# EAGLE schematic nutzen_03 (EAGLE 9.6.2)

## Sheet 1 of 2
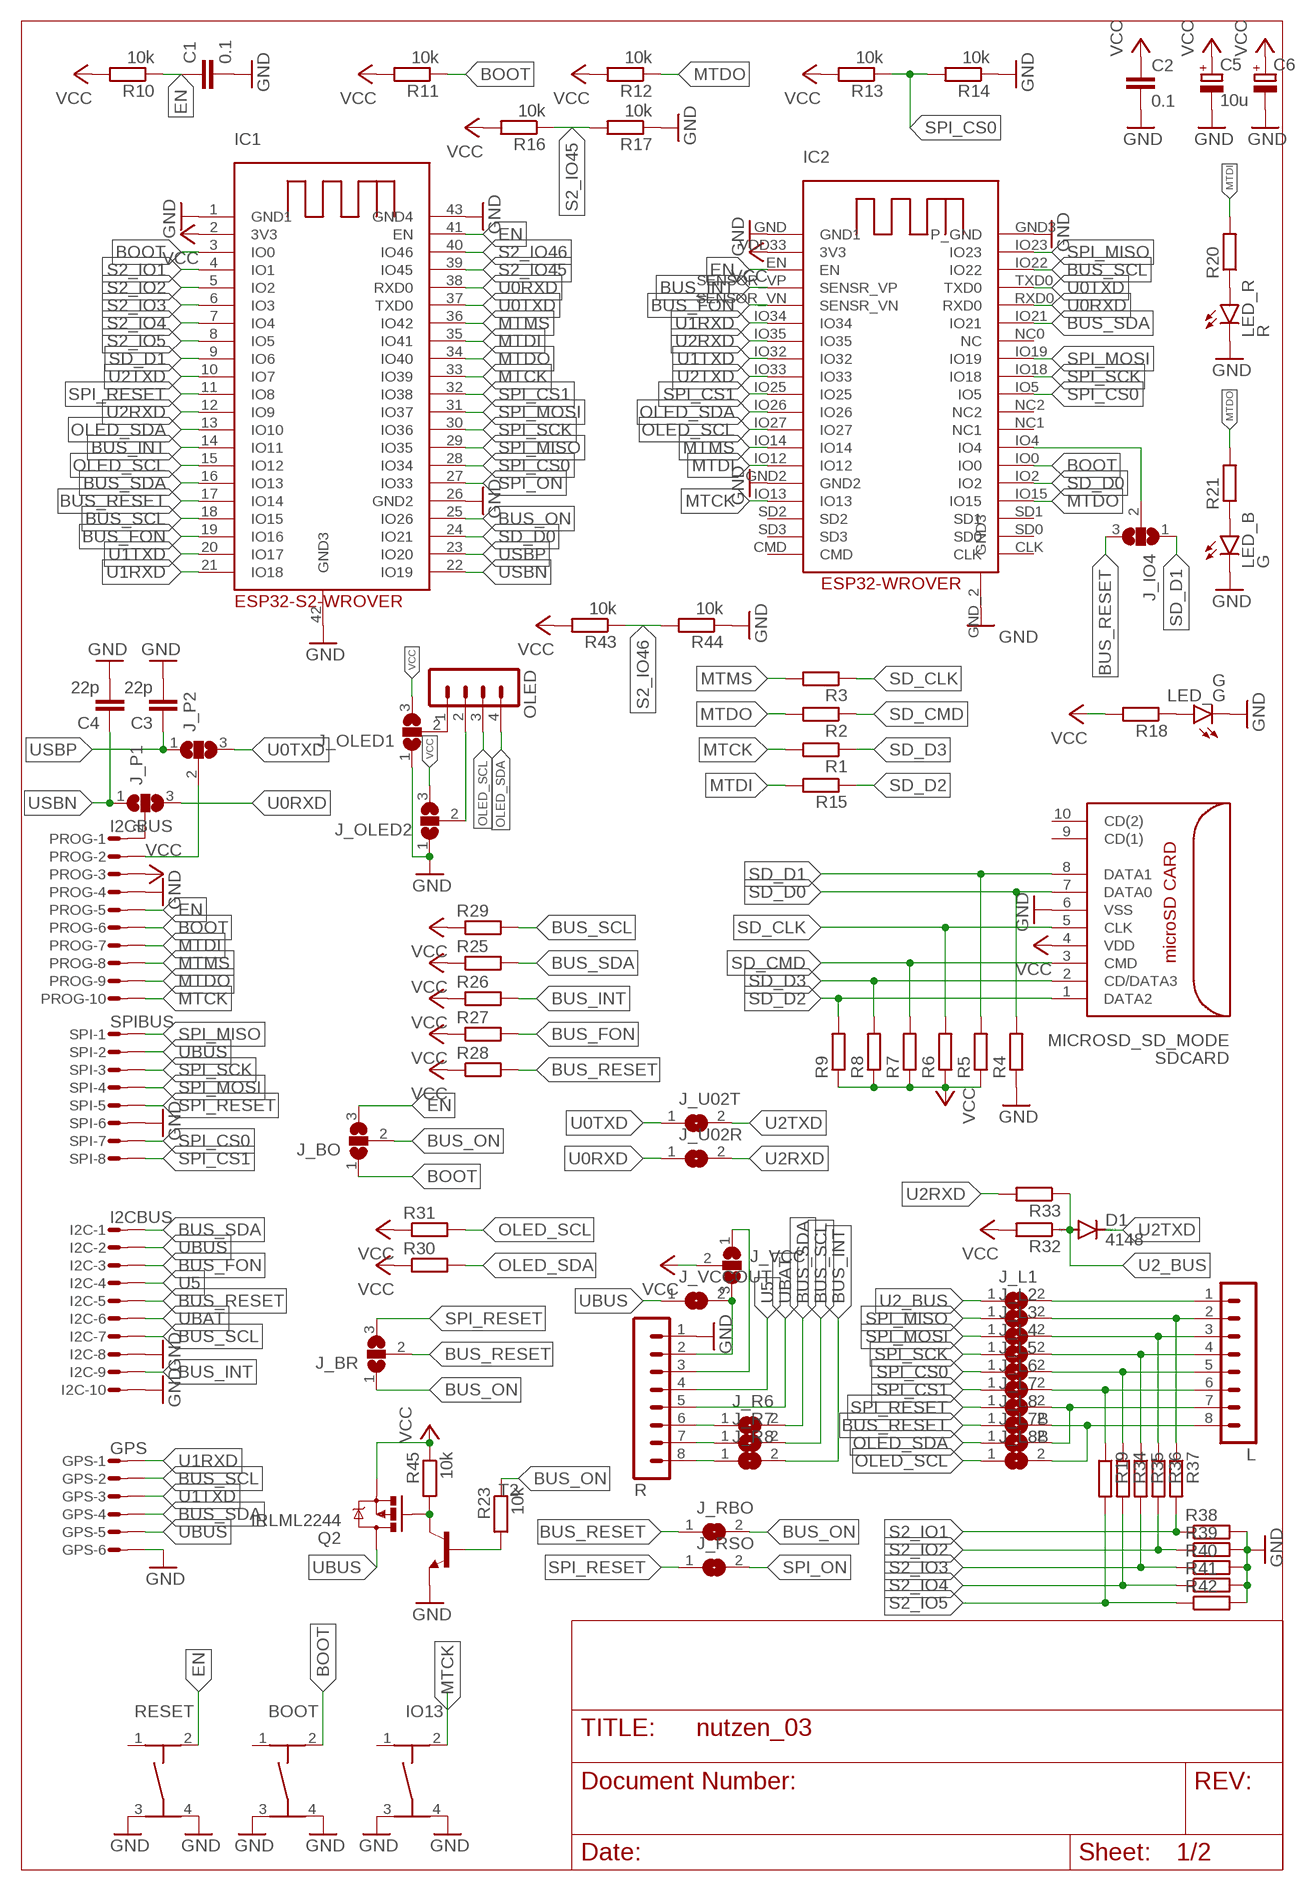
[diagram p0: schematic, sheet 1]

### Parts
BOOT  TASTER-9314_SMD  [TASTER-9314_SMD]
C1  0.1  C-EUC0805  [C0805]
C2  0.1  C-EUC0805  [C0805]
C3  22p  C-EUC0805  [C0805]
C4  22p  C-EUC0805  [C0805]
C5  10u  CPOL-EUB/3528-21W  [B/3528-21W]
C6  CPOL-EUC/6032-28R  [C/6032-28R]
D1  4148  DIODE-MINIMELF  [MINIMELF]
GPS  GPS  MICROMATCH-6SMD  [MICROMATCH-6SMD]
I2C  I2CBUS  MICROMATCH-10SMD  [MICROMATCH-10SMD]
IC1  ESP32-S2_WROVER  [ESP32-S2-WROVER]
IC2  ESP32-WROVER  [ESP32-WROVER]
IO13  TASTER-9314_SMD  [TASTER-9314_SMD]
J_BO  SJ2W  [SJ_2]
J_BR  SJ2W  [SJ_2]
J_IO4  SJ2W  [SJ_2]
J_L1  SJ  [SJ]
J_L2  SJ  [SJ]
J_L3  SJ  [SJ]
J_L4  SJ  [SJ]
J_L5  SJ  [SJ]
J_L6  SJ  [SJ]
J_L7  SJ  [SJ]
J_L7B  SJ  [SJ]
J_L8  SJ  [SJ]
J_L8B  SJ  [SJ]
J_OLED1  SJ2W  [SJ_2]
J_OLED2  SJ2W  [SJ_2]
J_P1  SJ2W  [SJ_2]
J_P2  SJ2W  [SJ_2]
J_R6  SJ  [SJ]
J_R7  SJ  [SJ]
J_R8  SJ  [SJ]
J_RBO  SJ  [SJ]
J_RSO  SJ  [SJ]
J_U02R  SJ  [SJ]
J_U02T  SJ  [SJ]
J_VCC  SJ2W  [SJ_2]
J_VCCOUT  SJ  [SJ]
L  MA08-1  [MA08-1]
LED_B  G  LEDCHIPLED_0805  [CHIPLED_0805]
LED_G  G  LEDCHIPLED_0805  [CHIPLED_0805]
LED_R  R  LEDCHIPLED_0805  [CHIPLED_0805]
OLED  MA04-1  [MA04-1]
PROG  I2CBUS  MICROMATCH-10SMD  [MICROMATCH-10SMD]
Q2  IRLML2244  MOSFET-PCHANNELIRLML2244  [SOT23-3]
R  MA08-1  [MA08-1]
R1  R-EU_R0805  [R0805]
R2  R-EU_R0805  [R0805]
R3  R-EU_R0805  [R0805]
R4  R-EU_R0805  [R0805]
R5  R-EU_R0805  [R0805]
R6  R-EU_R0805  [R0805]
R7  R-EU_R0805  [R0805]
R8  R-EU_R0805  [R0805]
R9  R-EU_R0805  [R0805]
R10  10k  R-EU_R0805  [R0805]
R11  10k  R-EU_R0805  [R0805]
R12  10k  R-EU_R0805  [R0805]
R13  10k  R-EU_R0805  [R0805]
R14  10k  R-EU_R0805  [R0805]
R15  R-EU_R0805  [R0805]
R16  10k  R-EU_R0805  [R0805]
R17  10k  R-EU_R0805  [R0805]
R18  R-EU_R0603  [R0603]
R19  R-EU_R0805  [R0805]
R20  R-EU_R0603  [R0603]
R21  R-EU_R0603  [R0603]
R23  10k  R-EU_R0805  [R0805]
R25  R-EU_R0805  [R0805]
R26  R-EU_R0805  [R0805]
R27  R-EU_R0805  [R0805]
R28  R-EU_R0805  [R0805]
R29  R-EU_R0805  [R0805]
R30  R-EU_R0805  [R0805]
R31  R-EU_R0805  [R0805]
R32  R-EU_R0805  [R0805]
R33  R-EU_R0805  [R0805]
R34  R-EU_R0805  [R0805]
R35  R-EU_R0805  [R0805]
R36  R-EU_R0805  [R0805]
R37  R-EU_R0805  [R0805]
R38  R-EU_R0805  [R0805]
R39  R-EU_R0805  [R0805]
R40  R-EU_R0805  [R0805]
R41  R-EU_R0805  [R0805]
R42  R-EU_R0805  [R0805]
R43  10k  R-EU_R0805  [R0805]
R44  10k  R-EU_R0805  [R0805]
R45  10k  R-EU_R0805  [R0805]
RESET  TASTER-9314_SMD  [TASTER-9314_SMD]
SDCARD  MICROSD_SD_MODE  [MICRO_SD_CONNECTOR]
SPI  SPIBUS  MICROMATCH-8SMD  [MICROMATCH-8-SMD]
T2  BC817-16-NPN-SOT23-BEC  [SOT23-BEC]

### Nets
BOOT: BOOT.2 IC1.3(IO0) IC2.IO0 J_BO.1 PROG.6 R11.1
BUS_FON: I2C.3 IC1.19(IO16) IC2.SENSOR_VN(SENSR_VN) R27.2
BUS_INT: I2C.9 IC1.14(IO11) IC2.SENSOR_VP(SENSR_VP) J_R8.2 R26.2
BUS_ON: IC1.25(IO26) J_BO.2 J_BR.1 J_RBO.2 R23.1
BUS_RESET: I2C.5 IC1.17(IO14) J_BR.2 J_IO4.3 J_L8.1 J_RBO.1 R28.2
BUS_SCL: GPS.2 I2C.7 IC1.18(IO15) IC2.IO22 J_R7.2 R29.2
BUS_SDA: GPS.4 I2C.1 IC1.16(IO13) IC2.IO21 J_R6.2 R25.2
EN: C1.1 IC1.41(EN) IC2.EN J_BO.3 PROG.5 R10.1 RESET.2
GND [gnd]: BOOT.3 BOOT.4 C1.2 C2.2 C3.2 C4.2 C5.- C6.- GPS.6 I2C.8 I2C.10 IC1.1(GND1) IC1.26(GND2) IC1.42(GND3) IC1.43(GND4) IC2.GND2 IC2.GND3(P_GND) IC2.GND(GND1) IC2.GND_2(GND3) IO13.3 IO13.4 J_OLED1.1 J_OLED2.1 LED_B.C LED_G.C LED_R.C PROG.4 R4.1 R14.1 R17.1 R38.2 R39.2 R40.2 R41.2 R42.2 R44.1 R.1 RESET.3 RESET.4 SDCARD.6(VSS) SPI.6 T2.E
LCD_1 [power]: J_OLED1.2 OLED.1
LCD_2 [power]: J_OLED2.2 OLED.2
MTCK: IC1.33(IO39) IC2.IO13 IO13.2 PROG.10 R1.2
MTDI: IC1.35(IO41) IC2.IO12 PROG.7 R15.2 R20.2
MTDO: IC1.34(IO40) IC2.IO15 PROG.9 R2.2 R12.1 R21.2
MTMS: IC1.36(IO42) IC2.IO14 PROG.8 R3.2
N$1: IC2.IO4 J_IO4.2
N$2: Q2.1(G) R45.2 T2.C
N$3: J_R6.1 R.6
N$4: LED_G.A R18.1
N$5: J_R7.1 R.7
N$6: J_P1.2 PROG.1
N$12: J_R8.1 R.8
N$18: R23.2 T2.B
N$20: LED_R.A R20.1
N$21: LED_B.A R21.1
N$24: J_L7.2 J_L7B.2 L.7
N$25: J_L6.2 L.6 R19.1
N$27: J_L8.2 J_L8B.2 L.8
N$28: J_L5.2 L.5 R34.1
N$29: J_L4.2 L.4 R35.1
N$30: J_L2.2 L.2 R37.1
N$31: J_L3.2 L.3 R36.1
N$32: J_L1.2 L.1
N$34: J_P2.2 PROG.2
OLED_SCL: IC1.15(IO12) IC2.IO27 J_L8B.1 OLED.3 R31.2
OLED_SDA: IC1.13(IO10) IC2.IO26 J_L7B.1 OLED.4 R30.2
S2_IO1: IC1.4(IO1) R37.2 R38.1
S2_IO2: IC1.5(IO2) R36.2 R39.1
S2_IO3: IC1.6(IO3) R35.2 R40.1
S2_IO4: IC1.7(IO4) R34.2 R41.1
S2_IO5: IC1.8(IO5) R19.2 R42.1
S2_IO45: IC1.39(IO45) R16.1 R17.2
S2_IO46: IC1.40(IO46) R43.1 R44.2
SD_CLK: R3.1 R6.2 SDCARD.5(CLK)
SD_CMD: R2.1 R7.2 SDCARD.3(CMD)
SD_D0: IC1.24(IO21) IC2.IO2 R4.2 SDCARD.7(DATA0)
SD_D1: IC1.9(IO6) J_IO4.1 R5.2 SDCARD.8(DATA1)
SD_D2: R9.2 R15.1 SDCARD.1(DATA2)
SD_D3: R1.1 R8.2 SDCARD.2(CD/DATA3)
SPI_CS0: IC1.28(IO34) IC2.IO5 J_L5.1 R13.1 R14.2 SPI.7
SPI_CS1: IC1.32(IO38) IC2.IO25 J_L6.1 SPI.8
SPI_MISO: IC1.29(IO35) IC2.IO23 J_L2.1 SPI.1
SPI_MOSI: IC1.31(IO37) IC2.IO19 J_L3.1 SPI.4
SPI_ON: IC1.27(IO33) J_RSO.2
SPI_RESET: IC1.11(IO8) J_BR.3 J_L7.1 J_RSO.1 SPI.5
SPI_SCK: IC1.30(IO36) IC2.IO18 J_L4.1 SPI.3
U0RXD: IC1.38(RXD0) IC2.RXD0 J_P1.3 J_U02R.1
U0TXD: IC1.37(TXD0) IC2.TXD0 J_P2.3 J_U02T.1
U1RXD: GPS.1 IC1.21(IO18) IC2.IO34
U1TXD: GPS.3 IC1.20(IO17) IC2.IO32
U2_BUS: D1.A J_L1.1 R32.1 R33.1
U2RXD: IC1.12(IO9) IC2.IO35 J_U02R.2 R33.2
U2TXD: D1.C IC1.10(IO7) IC2.IO33 J_U02T.2
U5 [power]: I2C.4 R.4
U33A [power]: J_VCC.3 J_VCCOUT.2 R.2
U33B [power]: J_VCC.1 R.3
UBAT [power]: I2C.6 R.5
UBUS [power]: GPS.5 I2C.2 J_VCCOUT.1 Q2.3(D) SPI.2
USBN: C4.1 IC1.22(IO19) J_P1.1
USBP: C3.1 IC1.23(IO20) J_P2.1
VCC [power]: C2.1 C5.+ C6.+ IC1.2(3V3) IC2.VDD33(3V3) J_OLED1.3 J_OLED2.3 J_VCC.2 PROG.3 Q2.2(S) R5.1 R6.1 R7.1 R8.1 R9.1 R10.2 R11.2 R12.2 R13.2 R16.2 R18.2 R25.1 R26.1 R27.1 R28.1 R29.1 R30.1 R31.1 R32.2 R43.2 R45.1 SDCARD.4(VDD)
Unconnected: BOOT.1 IC2.CLK IC2.CMD IC2.NC0(NC) IC2.NC1 IC2.NC2 IC2.SD0 IC2.SD1 IC2.SD2 IC2.SD3 IO13.1 RESET.1 SDCARD.9(CD(1)) SDCARD.10(CD(2))

## Sheet 2 of 2

## Library data of the parts
BOOT IO13 RESET = Ergaenzung:TASTER-9314_SMD
C1-C4 = rcl:C-EU: CAPACITOR, European symbol; SPICEPREFIX: C
C5 C6 = rcl:CPOL-EU: POLARIZED CAPACITOR, European symbol; SPICEPREFIX: C
D1 = diode:DIODE-: DIODE
GPS = con-amp-micromatch:MICROMATCH-6: MicroMaTch 6 7-215464-6 / 0-215464-6 Drawing Number C-215464 DDEController.pdf
I2C PROG = con-amp-micromatch:MICROMATCH-10: MicroMaTch 10 8-215464-0 / 1-215464-0 Drawing Number C-215464 DDEController.pdf
IC1 = ESP32-Wrover:ESP32-S2_WROVER
IC2 = ESP32-Wrover:ESP32-WROVER
J_BO J_BR J_IO4 J_OLED1 J_OLED2 J_P1 J_P2 J_VCC = jumper:SJ2W: SMD solder JUMPER
J_L1-J_L7 J_L7B J_L8 J_L8B J_R6-J_R8 J_RBO J_RSO J_U02R J_U02T J_VCCOUT = jumper:SJ: SMD solder JUMPER
L R = con-lstb:MA08-1: PIN HEADER; OC_FARNELL: unknown; OC_NEWARK: unknown
LED_B LED_G LED_R = led:LED: LED OSRAM: - CHIPLED LG R971, LG N971, LY N971, LG Q971, LY Q971, LO R971, LY R971 LH N974, LH R974 LS Q976, LO Q976, LY Q976 LO Q996 - Hyper CHIPLED LW Q18S LB Q993, LB Q99A, LB R99A - SideLED LS A670, LO A670, LY A670, LG A670, LP A670 LB A673, LV A673, LT A673, LW A673 LH A674 LY A675 LS A676, LA A676, LO A676, LY A676, LW A676 LS A679, LY A679, LG A679 - Hyper Micro SIDELED® LS Y876, LA Y876, LO Y876, LY Y876 LT Y87S - SmartLED LW L88C, LW L88S LB L89C, LB L89S, LG L890 LS L89K, LO L89K, LY L89K LS L896, LA L896, LO L896, LY L896 - TOPLED LS T670, LO T670, LY T670, LG T670, LP T670 LSG T670, LSP T670, LSY T670, LOP T670, LYG T670 LG T671, LOG T671, LSG T671 LB T673, LV T673, LT T673, LW T673 LH T674 LS T676, LA T676, LO T676, LY T676, LB T676, LH T676, LSB T676, LW T676 LB T67C, LV T67C, LT T67C, LS T67K, LO T67K, LY T67K, LW E67C LS E67B, LA E67B, LO E67B, LY E67B, LB E67C, LV E67C, LT E67C LW T67C LS T679, LY T679, LG T679 LS T770, LO T770, LY T770, LG T770, LP T770 LB T773, LV T773, LT T773, LW T773 LH T774 LS E675, LA E675, LY E675, LS T675 LS T776, LA T776, LO T776, LY T776, LB T776 LHGB T686 LT T68C, LB T68C - Hyper Mini TOPLED® LB M676 - Mini TOPLED Santana® LG M470 LS M47K, LO M47K, LY M47K Source: http://www.osram.convergy.de LUXEON: - LUMILED® LXK2-PW12-R00, LXK2-PW12-S00, LXK2-PW14-U00, LXK2-PW14-V00 LXK2-PM12-R00, LXK2-PM12-S00, LXK2-PM14-U00 LXK2-PE12-Q00, LXK2-PE12-R00, LXK2-PE12-S00, LXK2-PE14-T00, LXK2-PE14-U00 LXK2-PB12-K00, LXK2-PB12-L00, LXK2-PB12-M00, LXK2-PB14-N00, LXK2-PB14-P00, LXK2-PB14-Q00 LXK2-PR12-L00, LXK2-PR12-M00, LXK2-PR14-Q00, LXK2-PR14-R00 LXK2-PD12-Q00, LXK2-PD12-R00, LXK2-PD12-S00 LXK2-PH12-R00, LXK2-PH12-S00 LXK2-PL12-P00, LXK2-PL12-Q00, LXK2-PL12-R00 Source: www.luxeon.com KINGBRIGHT: KA-3528ASYC Source: www.kingbright.com
OLED = con-lstb:MA04-1: PIN HEADER; OC_FARNELL: unknown; OC_NEWARK: unknown
Q2 = User-Submitted:MOSFET-PCHANNEL: Generic PMOSFET IRLML2244 - TRANS-11153 (SOT-23 -20V -4.3A) (1.Gate 2.Source 3.Drain) FQP27P06 - COM-10349 <http://www.sparkfun.com/products/10349> (TO-220 -60V -27A) (1.Gate 2.Source 3.Drain); PROD_ID: TRANS-11153
R1-R21 R23 R25-R45 = rcl:R-EU_: RESISTOR, European symbol; SPICEPREFIX: R
SDCARD = con-molex-microsd:MICROSD_SD_MODE: MOLEX - 49225-0821 - CONNECTEUR MICRO SD PUSH/PUSH REV Fabricant: MOLEX Code commande Farnell: 1366700 <http://fr.farnell.com/molex/49225-0821/connecteur-micro-sd-push-push-rev/dp/1366700?Ntt=1366700> Référence fabricant: 49225-0821
SPI = con-amp-micromatch:MICROMATCH-8: MicroMaTch 8 7-215464-8 / 0-215464-8 Drawing Number C-215464 DDEController.pdf
T2 = transistor:*-NPN-: NPN Transistror BF959 corrected 2008.03.06

## Net classes
1 gnd: width 0.508 mm, drill 0.254 mm
2 power: width 0.508 mm, drill 0.254 mm